# Altium project LightControl_PowerBoard.PrjPcb (part 2 of 2)

## Sheet AC DC Powersupply.SchDoc: AC DC Powersupply
size A4; SheetNumber: 10; SheetTotal: 10
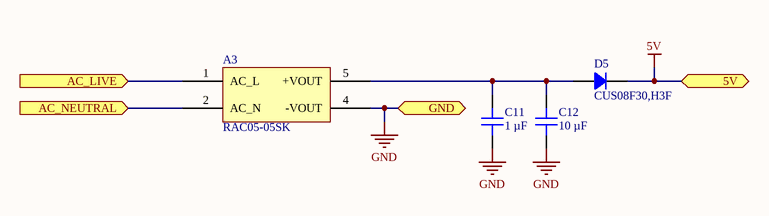
[diagram p9: AC DC Powersupply.SchDoc]

### Parts
A3  RAC05-05SK  [RECOM RAC05-K]
C11  1 µF  [CAP 0805_2012]
C12  10 µF  [CAP 0805_2012]
D5  CUS08F30,H3F  [SOD323]

### Ports
5V (bidir, see Review[2D], AC Detection[1A], Connectors[3A], Opto[1B], SSR Control[1A], Supply 5V[2B], Supply 15V[2B]), AC_LIVE (in, see Review[2D], AC Detection[3B], SSR Control[3D], SSR[2B]), AC_NEUTRAL (in, see Review[2D], AC Detection[3C]), GND (bidir, see Review[2D], AC Detection[1A], Connectors[3D], Supply 5V[2C], Supply 15V[2C])

### Nets
5V: D5.2 ; port 5V
GND: A3.4(-VOUT) C11.1 C12.1 ; port GND
AC_LIVE: A3.1(AC_L) ; port AC_LIVE
AC_NEUTRAL: A3.2(AC_N) ; port AC_NEUTRAL
NetA3_5: A3.5(+VOUT) C11.2 C12.2 D5.1

### Notes on the sheet
- Title
- Size:
- Date:
- A4
- Number:
- Time:
- Revision:
- Sheet
- of
- File:

### Library data of the parts
A3 = RAC05-05SK: AC/DC CONVERTER 5V 5W; Manufacturer: Recom Power; Current - Output (Max): 1A; Efficiency: 80%; Number of Outputs: 1; Voltage - Input: 85 ~ 264 VAC, 120 ~ 370 VDC; Applications: ITE (Commercial); ComponentLink1Description: Datasheet; ComponentLink1URL: https://www.recom-power.com/pdf/Powerline-AC-DC/RAC05-K.pdf; ComponentLink2Description: DigiKey Link; ComponentLink2URL: http://digikey.com/product-detail/en/recom-power/RAC05-05SK/945-3119-5-ND/7603372; Features: DC Input Capable, Universal Input; LastUpdated: 16/10/2023 19:45:24; Lifecycle Status: Active; Part Number: RAC05-05SK; Minimum Order: 1; Mounting Type: Through Hole; Operating Temperature: -25°C ~ 70°C (With Derating); Package / Case: 5-DIP Module; Packaging: Unknown; Part Status: Active; Power (Watts): 5W; Price: 9.63; Series: POWERLINE RAC05-K (5W); Size / Dimension: 1.00" L x 1.00" W x 0.65" H (25.4mm x 25.4mm x 16.5mm); Supplier 1: DigiKey; Supplier Part Number 1: 945-3119-5-ND; Type: Enclosed; Voltage - Output 1: 5V
C11 = GCJ21BR71H105KA01L: CAP CER 1UF 50V X7R 0805; manufacturer: Murata Electronics; Tolerance: ±10%; Part Number: GCJ21BR71H105KA01L; Value: 1 µF; Applications: Automotive, Boardflex Sensitive; Capacitance: 1 µF; componentlink1description: Datasheet; componentlink1url: https://www.murata.com/~/media/webrenewal/support/library/catalog/products/capacitor/mlcc/c03e.ashx?la=en-us; componentlink2description: DigiKey Link; componentlink2url: https://www.digikey.com/en/products/detail/murata-electronics/GCJ21BR71H105KA01L/4903512; Device Package: 0805 (2012 Metric); Features: Soft Termination; lastupdated: 5/12/2023 7:17:22 PM; Lifecycle Status: Active; Minimum Order: 1; Mounting Type: Surface Mount, MLCC; Operating Temperature: -55°C ~ 125°C; Package / Case: 0805 (2012 Metric); packaging: TapeAndReel; partid: 2709; Part Status: Active; price: 0.05; Ratings: AEC-Q200; series: GCJ; Size / Dimension: 0.079" L x 0.049" W (2.00mm x 1.25mm); Supplier 1: DigiKey; Supplier Part Number 1: 490-10667-1-ND; Temperature Coefficient: X7R; Thickness (Max): 0.057" (1.45mm); Voltage - Rated: 50V
C12 = CL21A106KOQNNNE: CAP CER 10UF 16V X5R 0805; manufacturer: Samsung Electro-Mechanics; Tolerance: ±10%; Part Number: CL21A106KOQNNNE; Value: 10 µF; Applications: General Purpose; Capacitance: 10 µF; componentlink1description: Datasheet; componentlink1url: http://www.samsungsem.com/kr/support/product-search/mlcc/CL21A106KOQNNNE.jsp; componentlink2description: DigiKey Link; componentlink2url: https://www.digikey.com/en/products/detail/samsung-electro-mechanics/CL21A106KOQNNNE/3886754; Device Package: 0805 (2012 Metric); lastupdated: 16/10/2023 19:12:13; Lifecycle Status: Active; Minimum Order: 1; Mounting Type: Surface Mount, MLCC; Operating Temperature: -55°C ~ 85°C; Package / Case: 0805 (2012 Metric); packaging: TapeAndReel; partid: 14297; Part Status: Active; price: 0.01; series: CL; Size / Dimension: 0.079" L x 0.049" W (2.00mm x 1.25mm); Supplier 1: DigiKey; Supplier Part Number 1: 1276-1096-1-ND; Temperature Coefficient: X5R; Thickness (Max): 0.055" (1.40mm); Voltage - Rated: 16V
D5 = CUS08F30,H3F: DIODE SCHOTTKY 30V 800MA USC; Manufacturer: Toshiba Semiconductor and Storage; Capacitance @ Vr, F: 170pF @ 0V, 1MHz; Current - Reverse Leakage @ Vr: 50 µA @ 30 V; Speed: Fast Recovery =< 500ns, > 200mA (Io); Voltage - Forward (Vf) (Max) @ If: 220 mV @ 10 mA; Part Number: CUS08F30,H3F; ComponentLink1Description: Datasheet; ComponentLink1URL: https://toshiba.semicon-storage.com/info/docget.jsp?did=9019&prodName=CUS08F30; ComponentLink2Description: DigiKey Link; ComponentLink2URL: https://www.digikey.com/en/products/detail/toshiba-semiconductor-and-storage/CUS08F30-H3F/5114298; Current - Average Rectified (Io): 800mA; Diode Type: Schottky; LastUpdated: 15/10/2023 20:39:09; Lifecycle Status: Active; Minimum Order: 1; Mounting Type: Surface Mount; Operating Temperature - Junction: 125°C (Max); Package / Case: SC-76, SOD-323; Packaging: TapeAndReel; PartId: 3013; Part Status: Active; Price: 0.04; Series: -; Supplier 1: DigiKey; Supplier Part Number 1: CUS08F30H3FCT-ND; Supplier Device Package: USC; Voltage - DC Reverse (Vr) (Max): 30 V

## Nets that join several sheets
5V: AC Detection (C4.2 IC2.8 R13.2), Supply 5V (A1.2 C2.2), Supply 15V (A2.2 C7.2), SSR/O0 (R4_O0.2 R8_O0.2 R12_O0.1 R17_O0.1), SSR/O1 (R4_O1.2 R8_O1.2 R12_O1.1 R17_O1.1), SSR/O2 (R4_O2.2 R8_O2.2 R12_O2.1 R17_O2.1), SSR/O3 (R4_O3.2 R8_O3.2 R12_O3.1 R17_O3.1), SSR/O4 (6 pins), Connectors (J2.1 J2.2 J2.49 J2.50), AC DC Powersupply (D5.2)
15V_ISO: AC Detection (C1.2 IC1.7 R3.2), Supply 5V (A1.4 C3.2), Supply 15V (A2.4 C8.2), SSR/SSR1 (R36_SSR1.2), SSR/SSR2 (R36_SSR2.2), SSR/SSR3 (R36_SSR3.2), SSR/SSR4 (R36_SSR4.2), SSR/SSR5 (R36_SSR5.2), SSR/SSR6 (R36_SSR6.2), SSR/SSR7 (R36_SSR7.2), SSR/SSR8 (R36_SSR8.2), SSR/SSR9 (R36_SSR9.2), SSR/SSR10 (R36_SSR10.2), SSR/SSR11 (R36_SSR11.2), SSR/SSR12 (R36_SSR12.2), SSR/SSR13 (R36_SSR13.2), SSR/SSR14 (R36_SSR14.2), SSR/SSR15 (R36_SSR15.2), SSR/SSR16 (R36_SSR16.2), SSR/SSR17 (R36_SSR17.2), SSR/SSR18 (R36_SSR18.2), SSR/O0 (R6_O0.2 R7_O0.2 R10_O0.2 R11_O0.2), SSR/O1 (R6_O1.2 R7_O1.2 R10_O1.2 R11_O1.2), SSR/O2 (R6_O2.2 R7_O2.2 R10_O2.2 R11_O2.2), SSR/O3 (R6_O3.2 R7_O3.2 R10_O3.2 R11_O3.2), SSR/O4 (R6_O4.2 R7_O4.2 R10_O4.2 R11_O4.2)
GND: AC Detection (6 pins), Supply 5V (A1.1 C2.1), Supply 15V (A2.1 C7.1), Connectors (26 pins), AC DC Powersupply (A3.4 C11.1 C12.1)
GND_ISO: AC Detection (5 pins), Supply 5V (A1.3 C3.1), Supply 15V (A2.3 C8.1), SSR Control (R5.2 R9.2), SSR/O0 (IC3_O0.9 IC3_O0.11 IC3_O0.13 IC3_O0.15), SSR/O1 (IC3_O1.9 IC3_O1.11 IC3_O1.13 IC3_O1.15), SSR/O2 (IC3_O2.9 IC3_O2.11 IC3_O2.13 IC3_O2.15), SSR/O3 (IC3_O3.9 IC3_O3.11 IC3_O3.13 IC3_O3.15), SSR/O4 (IC3_O4.9 IC3_O4.11 IC3_O4.13 IC3_O4.15)
AC_LIVE: AC Detection (D2.1 D4.4 IC2.3 IC2.4), SSR/SSR1 (RL1_SSR1.4), SSR/SSR2 (RL1_SSR2.4), SSR/SSR3 (RL1_SSR3.4), SSR/SSR4 (RL1_SSR4.4), SSR/SSR5 (RL1_SSR5.4), SSR/SSR6 (RL1_SSR6.4), SSR/SSR7 (RL1_SSR7.4), SSR/SSR8 (RL1_SSR8.4), SSR/SSR9 (RL1_SSR9.4), SSR/SSR10 (RL1_SSR10.4), SSR/SSR11 (RL1_SSR11.4), SSR/SSR12 (RL1_SSR12.4), SSR/SSR13 (RL1_SSR13.4), SSR/SSR14 (RL1_SSR14.4), SSR/SSR15 (RL1_SSR15.4), SSR/SSR16 (RL1_SSR16.4), SSR/SSR17 (RL1_SSR17.4), SSR/SSR18 (RL1_SSR18.4), AC DC Powersupply (A3.1)
AC_LIVEIN: Review (J5.1), AC Detection (F1.2)
AC_NEUTRAL: Review (J5.2), AC Detection (D1.1 D4.3), AC DC Powersupply (A3.2)
CSENSE: AC Detection (C5.2 IC2.7), Connectors (J2.44)
IN1: SSR/SSR1 (RL1_SSR1.2), SSR/O0 (IC3_O0.10 R11_O0.1)
IN2: SSR/SSR2 (RL1_SSR2.2), SSR/O0 (IC3_O0.12 R10_O0.1)
IN3: SSR/SSR3 (RL1_SSR3.2), SSR/O0 (IC3_O0.14 R7_O0.1)
IN4: SSR/SSR4 (RL1_SSR4.2), SSR/O0 (IC3_O0.16 R6_O0.1)
IN5: SSR/SSR5 (RL1_SSR5.2), SSR/O1 (IC3_O1.10 R11_O1.1)
IN6: SSR/SSR6 (RL1_SSR6.2), SSR/O1 (IC3_O1.12 R10_O1.1)
IN7: SSR/SSR7 (RL1_SSR7.2), SSR/O1 (IC3_O1.14 R7_O1.1)
IN8: SSR/SSR8 (RL1_SSR8.2), SSR/O1 (IC3_O1.16 R6_O1.1)
IN9: SSR/SSR9 (RL1_SSR9.2), SSR/O2 (IC3_O2.10 R11_O2.1)
IN10: SSR/SSR10 (RL1_SSR10.2), SSR/O2 (IC3_O2.12 R10_O2.1)
IN11: SSR/SSR11 (RL1_SSR11.2), SSR/O2 (IC3_O2.14 R7_O2.1)
IN12: SSR/SSR12 (RL1_SSR12.2), SSR/O2 (IC3_O2.16 R6_O2.1)
IN13: SSR/SSR13 (RL1_SSR13.2), SSR/O3 (IC3_O3.10 R11_O3.1)
IN14: SSR/SSR14 (RL1_SSR14.2), SSR/O3 (IC3_O3.12 R10_O3.1)
IN15: SSR/SSR15 (RL1_SSR15.2), SSR/O3 (IC3_O3.14 R7_O3.1)
IN16: SSR/SSR16 (RL1_SSR16.2), SSR/O3 (IC3_O3.16 R6_O3.1)
IN17: SSR/SSR17 (RL1_SSR17.2), SSR/O4 (IC3_O4.10 R11_O4.1)
IN18: SSR/SSR18 (RL1_SSR18.2), SSR/O4 (IC3_O4.12 R10_O4.1)
NetIC3_O4_14: SSR Control (R5.1), SSR/O4 (IC3_O4.14 R7_O4.1)
NetIC3_O4_16: SSR Control (R9.1), SSR/O4 (IC3_O4.16 R6_O4.1)
ZCD: AC Detection (D3.4 R13.1 R14.2), Connectors (J2.46)

## Assembly variants
Prototype AlCap ACDC: not fitted C10
Prototype CerCap ACDC: not fitted C9
Prototype AlCap No ACDC: not fitted A3 C10 C11 C12 D5
Prototype CerCap No ACDC: not fitted A3 C9 C11 C12 D5
Production AlCap ACDC: not fitted C10 R13 R14
Production CerCap ACDC: not fitted C9 R13 R14
Production AlCap No ACDC: not fitted A3 C10 C11 C12 D5 R13 R14
Production CerCap No ACDC: not fitted A3 C9 C11 C12 D5 R13 R14